# Altium schematic sheet multichannel.SchDoc
size 209 x 297 mm; PageSetup: Record=PageOptions|CenterHorizontal=False|CenterVertical=False|PrintScale=1.00|XCorrection=0.00|YCorrection=0.00|PrintKind=0|BorderSize=5000000|LeftOffset=0|BottomOffset=0|Orientation=1|PaperLength=1000|PaperWidth=1000|Scale=100|PaperSource=15|PrintQuality=-3|MediaType=1|DitherType=10|PrintScaleMode=0|PaperKind=A4|PaperIndex=9; TitleBlock_02_DocumentDesignator: BCAD.123456.001 Э3; TitleBlock_07_SheetNumber: 4
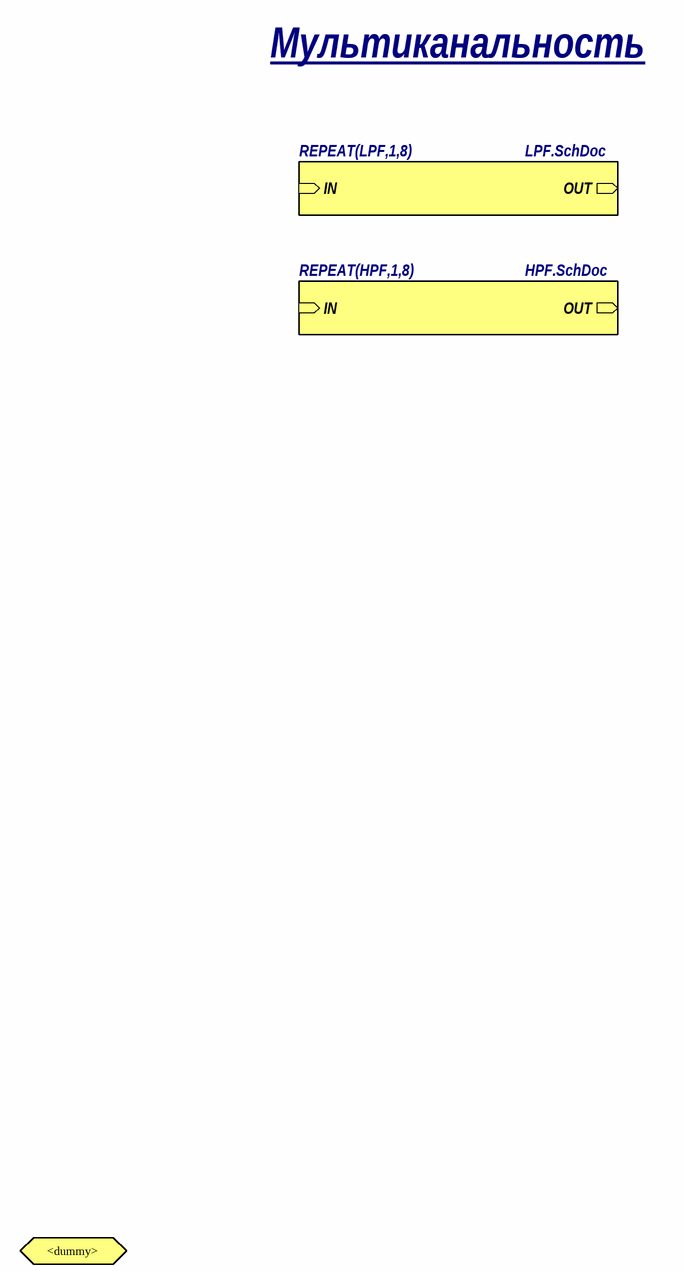
[diagram p0: multichannel.SchDoc]

## Sub-sheets
REPEAT(HPF,1,8) = HPF.SchDoc: IN (in), OUT (out)
REPEAT(LPF,1,8) = LPF.SchDoc: IN (in), OUT (out)

## Ports
<dummy>

## Notes on the sheet
- Мультиканальность
- Подп. и дата
- Инв. № дубл.
- Взам. инв. №
- Инв. № подл.
- Изм.
- Лист
- № докум.
- Подп.
- Дата
- Копировал
- Формат А4